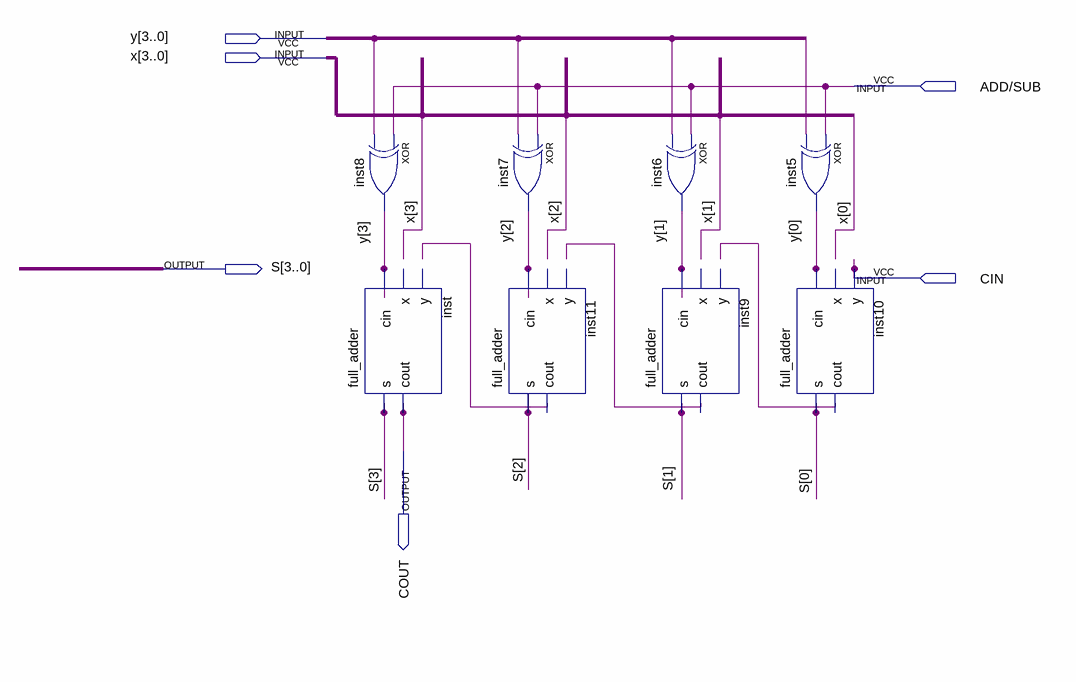
[diagram p0: schematic sheet]
// Quartus schematic adder_subtractor.bdf as structural Verilog: 8 symbols, 6 pins
module adder_subtractor (
  input  [3:0] y,
  input  [3:0] x,
  input  \ADD/SUB ,
  input  CIN,
  output [3:0] S,
  output COUT
);

  wire inst5_out, inst6_out, inst7_out, inst8_out;

  xor inst8 (inst8_out, \ADD/SUB , y[3]);
  full_adder inst (.cin(inst8_out), .s(S[3]), .cout(COUT));  // open: x, y
  xor inst7 (inst7_out, \ADD/SUB , y[2]);
  full_adder inst11 (.cin(inst7_out), .s(S[2]));  // open: x, y, cout
  xor inst6 (inst6_out, \ADD/SUB , y[1]);
  full_adder inst9 (.cin(inst6_out), .s(S[1]));  // open: x, y, cout
  xor inst5 (inst5_out, \ADD/SUB , y[0]);
  full_adder inst10 (.cin(inst5_out), .y(CIN), .s(S[0]));  // open: x, cout
endmodule
